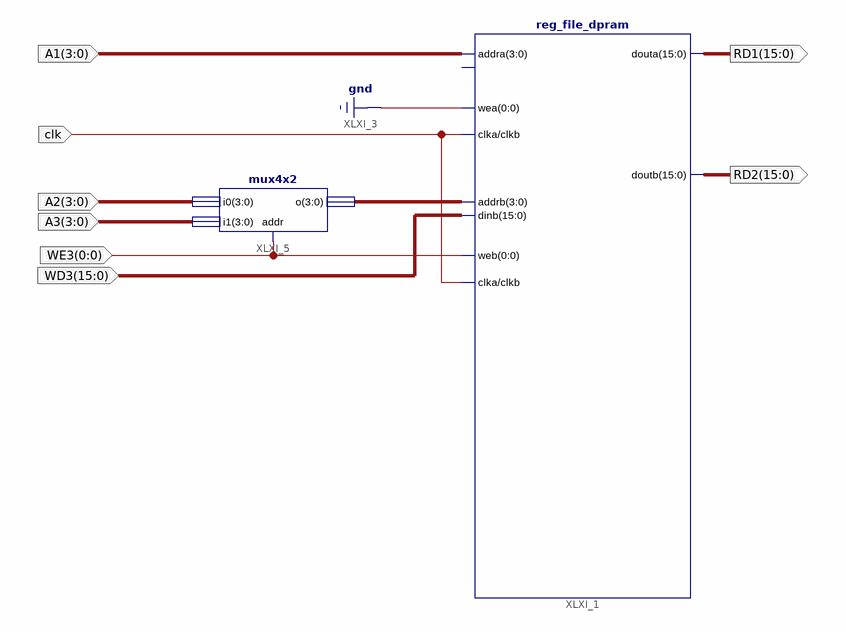
[diagram p0: schematic sheet 1]
// Xilinx ISE schematic reg_file.sch (spartan3e) as structural Verilog: 2 symbols, 8 ports
module reg_file (
  input  clk,
  input  [3:0] A1,
  input  [3:0] A2,
  input  [3:0] A3,
  input  [0:0] WE3,
  input  [15:0] WD3,
  output [15:0] RD1,
  output [15:0] RD2
);

  wire [3:0] XLXN_10;

  reg_file_dpram XLXI_1 (
    .addra(A1), .wea(1'b0), .clka(clk), .addrb(XLXN_10), .dinb(WD3), .web(WE3[0]), .clkb(clk), .douta(RD1),
    .doutb(RD2));  // open: dina
  mux4x2 XLXI_5 (.addr(WE3[0]), .i0(A2), .i1(A3), .o(XLXN_10));
endmodule
